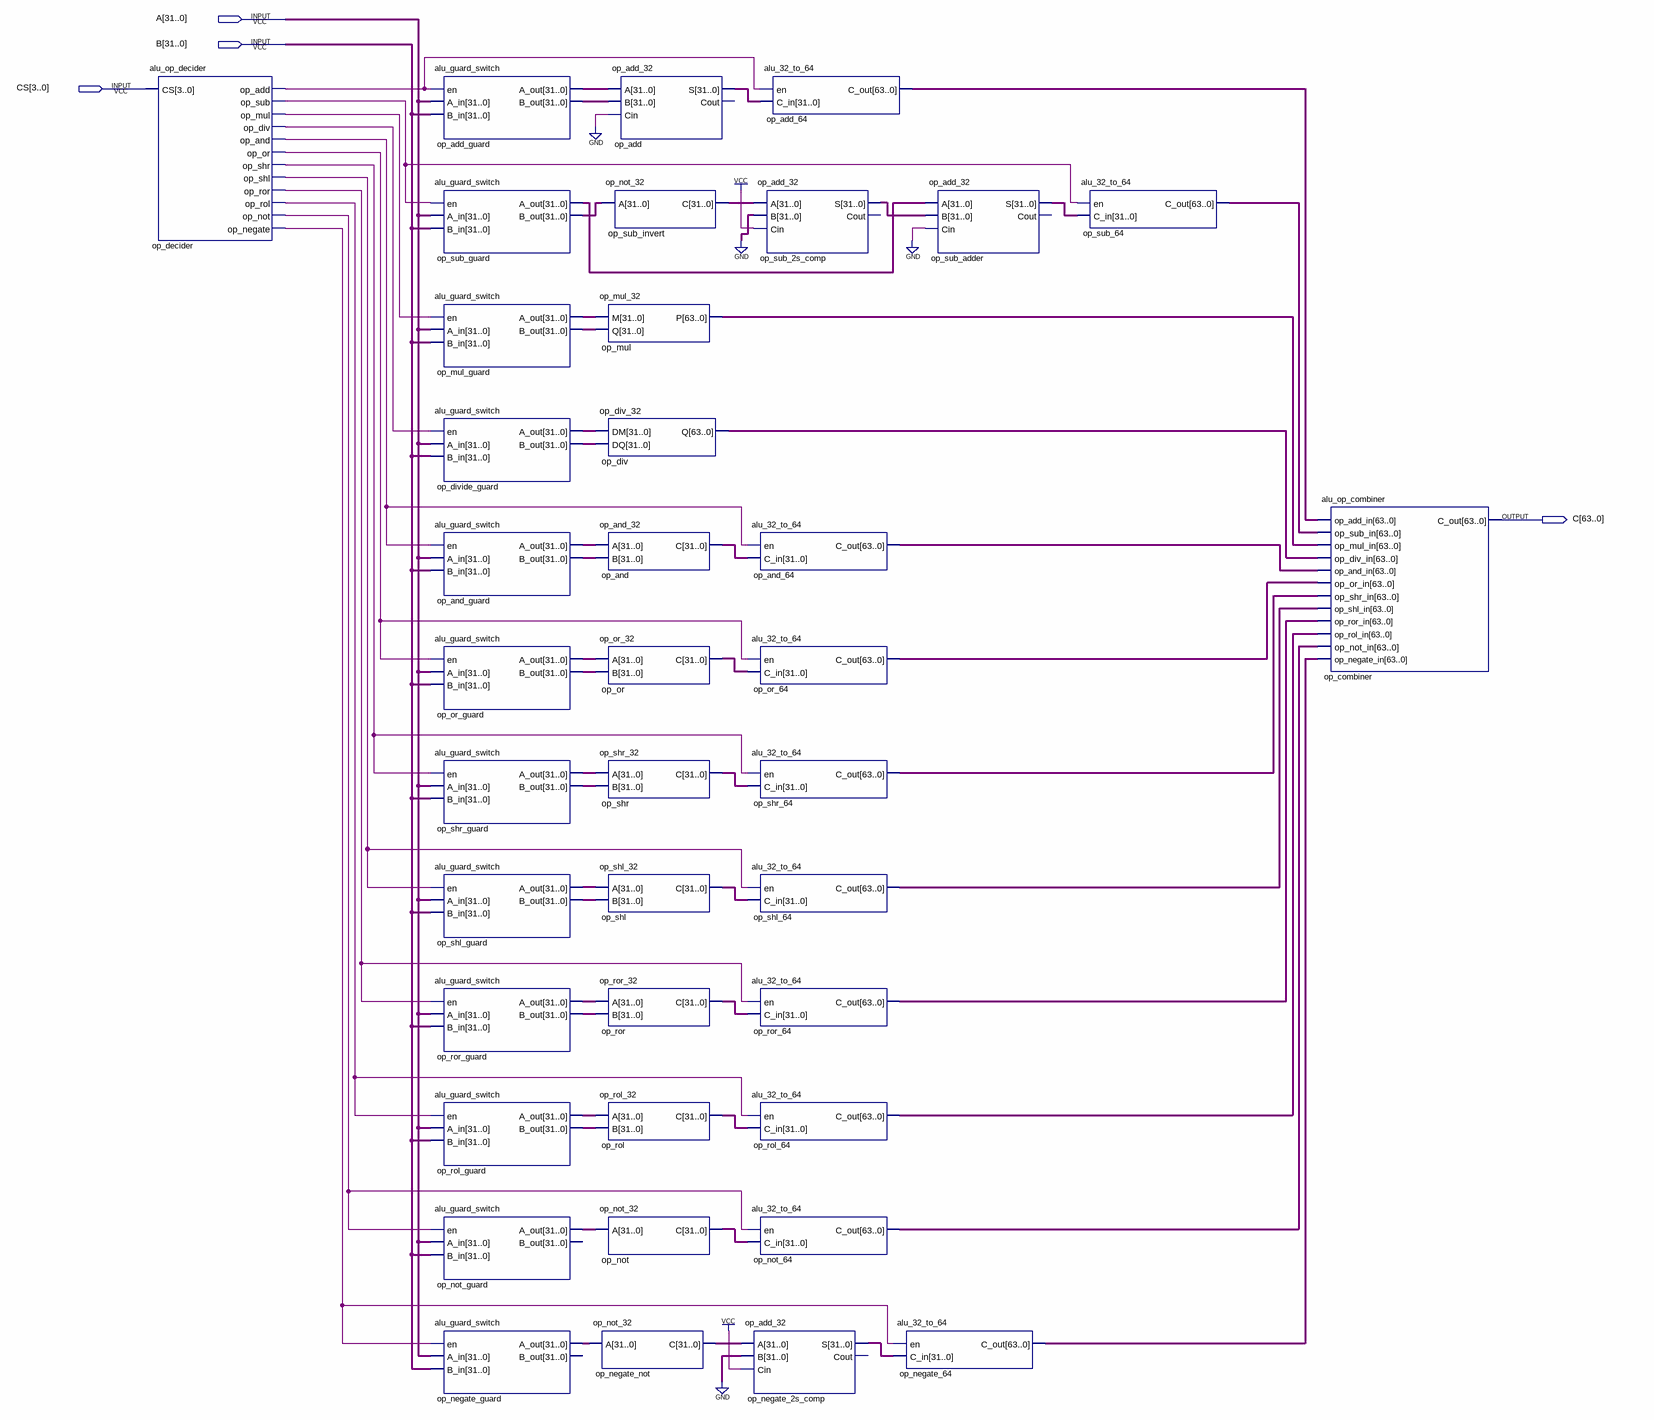
[diagram p0: schematic sheet]
// Quartus schematic alu.bdf as structural Verilog: 39 symbols, 4 pins
module alu (
  input  [31:0] A,
  input  [31:0] B,
  input  [3:0] CS,
  output [63:0] C
);

  wire op_decider_op_add, op_decider_op_and, op_decider_op_div, op_decider_op_mul, op_decider_op_negate,
       op_decider_op_not, op_decider_op_or, op_decider_op_rol, op_decider_op_ror, op_decider_op_shl,
       op_decider_op_shr, op_decider_op_sub;
  wire [31:0] op_add_guard_a_out, op_add_guard_b_out, op_add_s, op_and_c, op_and_guard_a_out,
       op_and_guard_b_out, op_divide_guard_a_out, op_divide_guard_b_out, op_mul_guard_a_out,
       op_mul_guard_b_out, op_negate_2s_comp_s, op_negate_guard_a_out, op_negate_not_c, op_not_c,
       op_not_guard_a_out, op_or_c, op_or_guard_a_out, op_or_guard_b_out, op_rol_c, op_rol_guard_a_out,
       op_rol_guard_b_out, op_ror_c, op_ror_guard_a_out, op_ror_guard_b_out, op_shl_c, op_shl_guard_a_out,
       op_shl_guard_b_out, op_shr_c, op_shr_guard_a_out, op_shr_guard_b_out, op_sub_2s_comp_s,
       op_sub_adder_s, op_sub_guard_a_out, op_sub_guard_b_out, op_sub_invert_c;
  wire [63:0] op_add_64_c_out, op_and_64_c_out, op_div_q, op_mul_p, op_negate_64_c_out, op_not_64_c_out,
       op_or_64_c_out, op_rol_64_c_out, op_ror_64_c_out, op_shl_64_c_out, op_shr_64_c_out, op_sub_64_c_out;

  alu_op_decider op_decider (
    .CS(CS), .op_add(op_decider_op_add), .op_sub(op_decider_op_sub), .op_mul(op_decider_op_mul),
    .op_div(op_decider_op_div), .op_and(op_decider_op_and), .op_or(op_decider_op_or),
    .op_shr(op_decider_op_shr), .op_shl(op_decider_op_shl), .op_ror(op_decider_op_ror),
    .op_rol(op_decider_op_rol), .op_not(op_decider_op_not), .op_negate(op_decider_op_negate));
  alu_guard_switch op_add_guard (
    .en(op_decider_op_add), .A_in(A), .B_in(B), .A_out(op_add_guard_a_out), .B_out(op_add_guard_b_out));
  alu_guard_switch op_sub_guard (
    .en(op_decider_op_sub), .A_in(A), .B_in(B), .A_out(op_sub_guard_a_out), .B_out(op_sub_guard_b_out));
  alu_guard_switch op_mul_guard (
    .en(op_decider_op_mul), .A_in(A), .B_in(B), .A_out(op_mul_guard_a_out), .B_out(op_mul_guard_b_out));
  alu_guard_switch op_divide_guard (
    .en(op_decider_op_div), .A_in(A), .B_in(B), .A_out(op_divide_guard_a_out), .B_out(op_divide_guard_b_out));
  alu_guard_switch op_and_guard (
    .en(op_decider_op_and), .A_in(A), .B_in(B), .A_out(op_and_guard_a_out), .B_out(op_and_guard_b_out));
  alu_guard_switch op_or_guard (
    .en(op_decider_op_or), .A_in(A), .B_in(B), .A_out(op_or_guard_a_out), .B_out(op_or_guard_b_out));
  alu_guard_switch op_shr_guard (
    .en(op_decider_op_shr), .A_in(A), .B_in(B), .A_out(op_shr_guard_a_out), .B_out(op_shr_guard_b_out));
  alu_guard_switch op_shl_guard (
    .en(op_decider_op_shl), .A_in(A), .B_in(B), .A_out(op_shl_guard_a_out), .B_out(op_shl_guard_b_out));
  alu_guard_switch op_ror_guard (
    .en(op_decider_op_ror), .A_in(A), .B_in(B), .A_out(op_ror_guard_a_out), .B_out(op_ror_guard_b_out));
  alu_guard_switch op_rol_guard (
    .en(op_decider_op_rol), .A_in(A), .B_in(B), .A_out(op_rol_guard_a_out), .B_out(op_rol_guard_b_out));
  alu_guard_switch op_not_guard (
    .en(op_decider_op_not), .A_in(A), .B_in(B), .A_out(op_not_guard_a_out));  // open: B_out
  alu_guard_switch op_negate_guard (
    .en(op_decider_op_negate), .A_in(A), .B_in(B), .A_out(op_negate_guard_a_out));  // open: B_out
  op_mul_32 op_mul (.M(op_mul_guard_a_out), .Q(op_mul_guard_b_out), .P(op_mul_p));
  op_div_32 op_div (.DM(op_divide_guard_a_out), .DQ(op_divide_guard_b_out), .Q(op_div_q));
  op_and_32 op_and (.A(op_and_guard_a_out), .B(op_and_guard_b_out), .C(op_and_c));
  op_or_32 op_or (.A(op_or_guard_a_out), .B(op_or_guard_b_out), .C(op_or_c));
  op_shr_32 op_shr (.A(op_shr_guard_a_out), .B(op_shr_guard_b_out), .C(op_shr_c));
  op_shl_32 op_shl (.A(op_shl_guard_a_out), .B(op_shl_guard_b_out), .C(op_shl_c));
  op_ror_32 op_ror (.A(op_ror_guard_a_out), .B(op_ror_guard_b_out), .C(op_ror_c));
  op_rol_32 op_rol (.A(op_rol_guard_a_out), .B(op_rol_guard_b_out), .C(op_rol_c));
  op_not_32 op_not (.A(op_not_guard_a_out), .C(op_not_c));
  op_not_32 op_negate_not (.A(op_negate_guard_a_out), .C(op_negate_not_c));
  op_add_32 op_add (.A(op_add_guard_a_out), .B(op_add_guard_b_out), .Cin(1'b0), .S(op_add_s));  // open: Cout
  op_not_32 op_sub_invert (.A(op_sub_guard_b_out), .C(op_sub_invert_c));
  alu_32_to_64 op_and_64 (.en(op_decider_op_and), .C_in(op_and_c), .C_out(op_and_64_c_out));
  alu_32_to_64 op_or_64 (.en(op_decider_op_or), .C_in(op_or_c), .C_out(op_or_64_c_out));
  alu_32_to_64 op_shr_64 (.en(op_decider_op_shr), .C_in(op_shr_c), .C_out(op_shr_64_c_out));
  alu_32_to_64 op_shl_64 (.en(op_decider_op_shl), .C_in(op_shl_c), .C_out(op_shl_64_c_out));
  alu_32_to_64 op_ror_64 (.en(op_decider_op_ror), .C_in(op_ror_c), .C_out(op_ror_64_c_out));
  alu_32_to_64 op_rol_64 (.en(op_decider_op_rol), .C_in(op_rol_c), .C_out(op_rol_64_c_out));
  alu_32_to_64 op_not_64 (.en(op_decider_op_not), .C_in(op_not_c), .C_out(op_not_64_c_out));
  op_add_32 op_negate_2s_comp (.A(op_negate_not_c), .B({32{1'b0}}), .Cin(1'b1), .S(op_negate_2s_comp_s));  // open: Cout
  alu_32_to_64 op_add_64 (.en(op_decider_op_add), .C_in(op_add_s), .C_out(op_add_64_c_out));
  op_add_32 op_sub_2s_comp (.A(op_sub_invert_c), .B({32{1'b0}}), .Cin(1'b1), .S(op_sub_2s_comp_s));  // open: Cout
  alu_32_to_64 op_negate_64 (.en(op_decider_op_negate), .C_in(op_negate_2s_comp_s), .C_out(op_negate_64_c_out));
  op_add_32 op_sub_adder (.A(op_sub_guard_a_out), .B(op_sub_2s_comp_s), .Cin(1'b0), .S(op_sub_adder_s));  // open: Cout
  alu_32_to_64 op_sub_64 (.en(op_decider_op_sub), .C_in(op_sub_adder_s), .C_out(op_sub_64_c_out));
  alu_op_combiner op_combiner (
    .op_add_in(op_add_64_c_out), .op_sub_in(op_sub_64_c_out), .op_mul_in(op_mul_p), .op_div_in(op_div_q),
    .op_and_in(op_and_64_c_out), .op_or_in(op_or_64_c_out), .op_shr_in(op_shr_64_c_out),
    .op_shl_in(op_shl_64_c_out), .op_ror_in(op_ror_64_c_out), .op_rol_in(op_rol_64_c_out),
    .op_not_in(op_not_64_c_out), .op_negate_in(op_negate_64_c_out), .C_out(C));
endmodule
